# Altium schematic sheet fpga31-serdes-power.SchDoc
size Tabloid; SheetNumber: 54; SheetTotal: 71
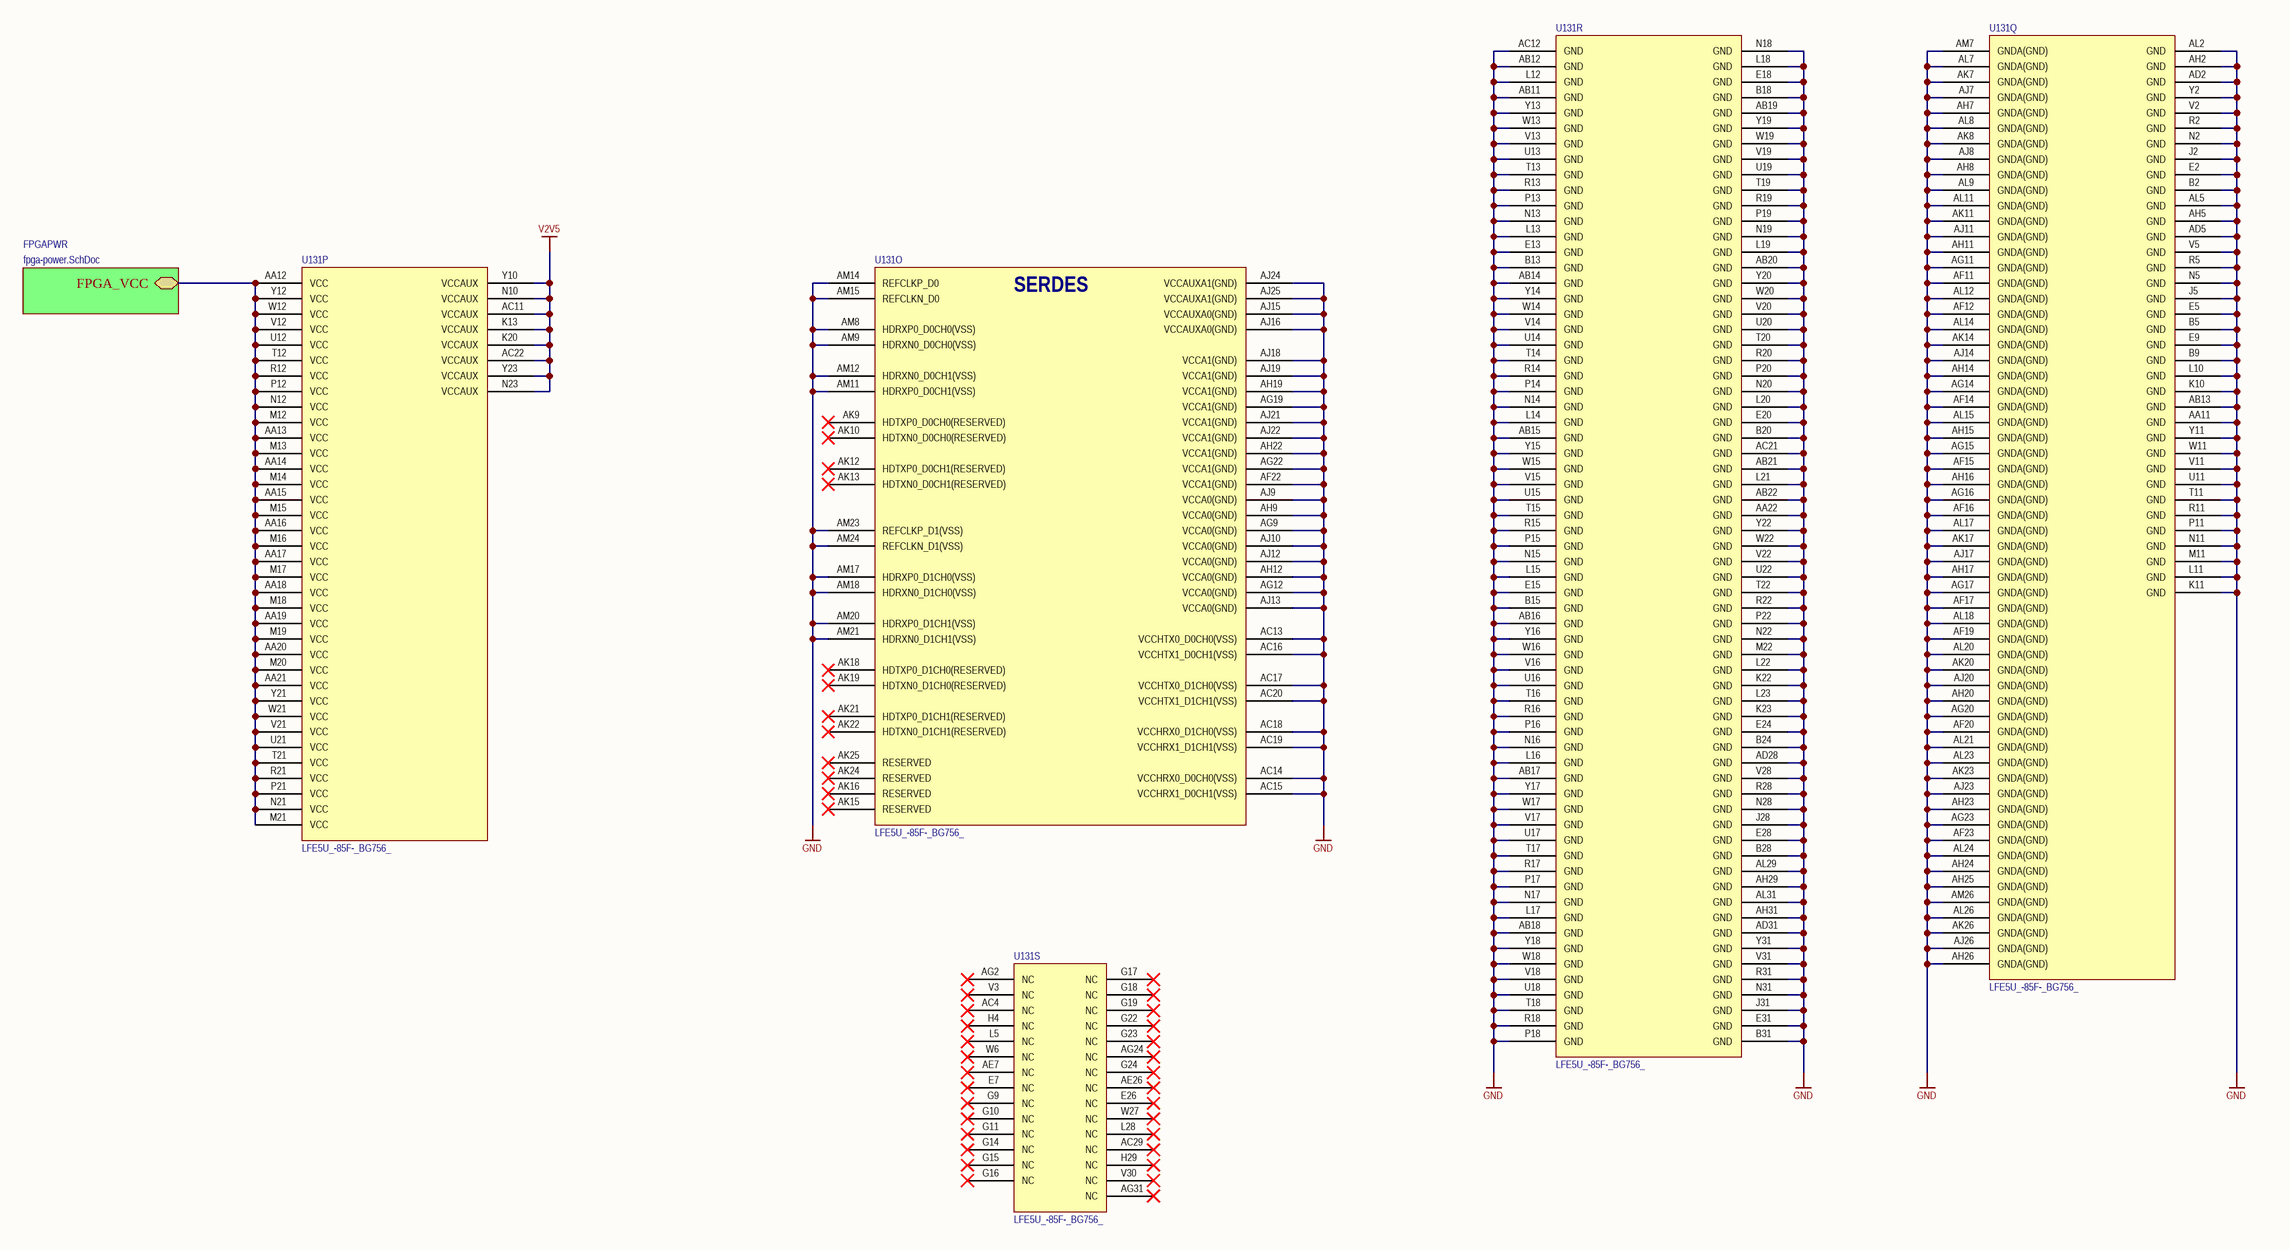
[diagram p0: fpga31-serdes-power.SchDoc]

## Parts
U131  LFE5U_-85F-_BG756_  [caBGA756]  (parts O,P,Q,R,S of 19)

## Sub-sheets
FPGAPWR = fpga-power.SchDoc: FPGA_VCC

## Nets
GND: U131.AA11(GND) U131.AA22(GND) U131.AB11(GND) U131.AB12(GND) U131.AB13(GND) U131.AB14(GND) U131.AB15(GND) U131.AB16(GND) U131.AB17(GND) U131.AB18(GND) U131.AB19(GND) U131.AB20(GND) U131.AB21(GND) U131.AB22(GND) U131.AC12(GND) U131.AC13(VCCHTX0_D0CH0(VSS)) U131.AC14(VCCHRX0_D0CH0(VSS)) U131.AC15(VCCHRX1_D0CH1(VSS)) U131.AC16(VCCHTX1_D0CH1(VSS)) U131.AC17(VCCHTX0_D1CH0(VSS)) U131.AC18(VCCHRX0_D1CH0(VSS)) U131.AC19(VCCHRX1_D1CH1(VSS)) U131.AC20(VCCHTX1_D1CH1(VSS)) U131.AC21(GND) U131.AD2(GND) U131.AD5(GND) U131.AD28(GND) U131.AD31(GND) U131.AF11(GNDA(GND)) U131.AF12(GNDA(GND)) U131.AF14(GNDA(GND)) U131.AF15(GNDA(GND)) U131.AF16(GNDA(GND)) U131.AF17(GNDA(GND)) U131.AF19(GNDA(GND)) U131.AF20(GNDA(GND)) U131.AF22(VCCA1(GND)) U131.AF23(GNDA(GND)) U131.AG9(VCCA0(GND)) U131.AG11(GNDA(GND)) U131.AG12(VCCA0(GND)) U131.AG14(GNDA(GND)) U131.AG15(GNDA(GND)) U131.AG16(GNDA(GND)) U131.AG17(GNDA(GND)) U131.AG19(VCCA1(GND)) U131.AG20(GNDA(GND)) U131.AG22(VCCA1(GND)) U131.AG23(GNDA(GND)) U131.AH2(GND) U131.AH5(GND) U131.AH7(GNDA(GND)) U131.AH8(GNDA(GND)) U131.AH9(VCCA0(GND)) U131.AH11(GNDA(GND)) U131.AH12(VCCA0(GND)) U131.AH14(GNDA(GND)) U131.AH15(GNDA(GND)) U131.AH16(GNDA(GND)) U131.AH17(GNDA(GND)) U131.AH19(VCCA1(GND)) U131.AH20(GNDA(GND)) U131.AH22(VCCA1(GND)) U131.AH23(GNDA(GND)) U131.AH24(GNDA(GND)) U131.AH25(GNDA(GND)) U131.AH26(GNDA(GND)) U131.AH29(GND) U131.AH31(GND) U131.AJ7(GNDA(GND)) U131.AJ8(GNDA(GND)) U131.AJ9(VCCA0(GND)) U131.AJ10(VCCA0(GND)) U131.AJ11(GNDA(GND)) U131.AJ12(VCCA0(GND)) U131.AJ13(VCCA0(GND)) U131.AJ14(GNDA(GND)) U131.AJ15(VCCAUXA0(GND)) U131.AJ16(VCCAUXA0(GND)) U131.AJ17(GNDA(GND)) U131.AJ18(VCCA1(GND)) U131.AJ19(VCCA1(GND)) U131.AJ20(GNDA(GND)) U131.AJ21(VCCA1(GND)) U131.AJ22(VCCA1(GND)) U131.AJ23(GNDA(GND)) U131.AJ24(VCCAUXA1(GND)) U131.AJ25(VCCAUXA1(GND)) U131.AJ26(GNDA(GND)) U131.AK7(GNDA(GND)) U131.AK8(GNDA(GND)) U131.AK11(GNDA(GND)) U131.AK14(GNDA(GND)) U131.AK17(GNDA(GND)) U131.AK20(GNDA(GND)) U131.AK23(GNDA(GND)) U131.AK26(GNDA(GND)) U131.AL2(GND) U131.AL5(GND) U131.AL7(GNDA(GND)) U131.AL8(GNDA(GND)) U131.AL9(GNDA(GND)) U131.AL11(GNDA(GND)) U131.AL12(GNDA(GND)) U131.AL14(GNDA(GND)) U131.AL15(GNDA(GND)) U131.AL17(GNDA(GND)) U131.AL18(GNDA(GND)) U131.AL20(GNDA(GND)) U131.AL21(GNDA(GND)) U131.AL23(GNDA(GND)) U131.AL24(GNDA(GND)) U131.AL26(GNDA(GND)) U131.AL29(GND) U131.AL31(GND) U131.AM7(GNDA(GND)) U131.AM8(HDRXP0_D0CH0(VSS)) U131.AM9(HDRXN0_D0CH0(VSS)) U131.AM11(HDRXP0_D0CH1(VSS)) U131.AM12(HDRXN0_D0CH1(VSS)) U131.AM14(REFCLKP_D0) U131.AM15(REFCLKN_D0) U131.AM17(HDRXP0_D1CH0(VSS)) U131.AM18(HDRXN0_D1CH0(VSS)) U131.AM20(HDRXP0_D1CH1(VSS)) U131.AM21(HDRXN0_D1CH1(VSS)) U131.AM23(REFCLKP_D1(VSS)) U131.AM24(REFCLKN_D1(VSS)) U131.AM26(GNDA(GND)) U131.B2(GND) U131.B5(GND) U131.B9(GND) U131.B13(GND) U131.B15(GND) U131.B18(GND) U131.B20(GND) U131.B24(GND) U131.B28(GND) U131.B31(GND) U131.E2(GND) U131.E5(GND) U131.E9(GND) U131.E13(GND) U131.E15(GND) U131.E18(GND) U131.E20(GND) U131.E24(GND) U131.E28(GND) U131.E31(GND) U131.J2(GND) U131.J5(GND) U131.J28(GND) U131.J31(GND) U131.K10(GND) U131.K11(GND) U131.K22(GND) U131.K23(GND) U131.L10(GND) U131.L11(GND) U131.L12(GND) U131.L13(GND) U131.L14(GND) U131.L15(GND) U131.L16(GND) U131.L17(GND) U131.L18(GND) U131.L19(GND) U131.L20(GND) U131.L21(GND) U131.L22(GND) U131.L23(GND) U131.M11(GND) U131.M22(GND) U131.N2(GND) U131.N5(GND) U131.N11(GND) U131.N13(GND) U131.N14(GND) U131.N15(GND) U131.N16(GND) U131.N17(GND) U131.N18(GND) U131.N19(GND) U131.N20(GND) U131.N22(GND) U131.N28(GND) U131.N31(GND) U131.P11(GND) U131.P13(GND) U131.P14(GND) U131.P15(GND) U131.P16(GND) U131.P17(GND) U131.P18(GND) U131.P19(GND) U131.P20(GND) U131.P22(GND) U131.R2(GND) U131.R5(GND) U131.R11(GND) U131.R13(GND) U131.R14(GND) U131.R15(GND) U131.R16(GND) U131.R17(GND) U131.R18(GND) U131.R19(GND) U131.R20(GND) U131.R22(GND) U131.R28(GND) U131.R31(GND) U131.T11(GND) U131.T13(GND) U131.T14(GND) U131.T15(GND) U131.T16(GND) U131.T17(GND) U131.T18(GND) U131.T19(GND) U131.T20(GND) U131.T22(GND) U131.U11(GND) U131.U13(GND) U131.U14(GND) U131.U15(GND) U131.U16(GND) U131.U17(GND) U131.U18(GND) U131.U19(GND) U131.U20(GND) U131.U22(GND) U131.V2(GND) U131.V5(GND) U131.V11(GND) U131.V13(GND) U131.V14(GND) U131.V15(GND) U131.V16(GND) U131.V17(GND) U131.V18(GND) U131.V19(GND) U131.V20(GND) U131.V22(GND) U131.V28(GND) U131.V31(GND) U131.W11(GND) U131.W13(GND) U131.W14(GND) U131.W15(GND) U131.W16(GND) U131.W17(GND) U131.W18(GND) U131.W19(GND) U131.W20(GND) U131.W22(GND) U131.Y2(GND) U131.Y11(GND) U131.Y13(GND) U131.Y14(GND) U131.Y15(GND) U131.Y16(GND) U131.Y17(GND) U131.Y18(GND) U131.Y19(GND) U131.Y20(GND) U131.Y22(GND) U131.Y31(GND)
V2V5: U131.AC11(VCCAUX) U131.AC22(VCCAUX) U131.K13(VCCAUX) U131.K20(VCCAUX) U131.N10(VCCAUX) U131.N23(VCCAUX) U131.Y10(VCCAUX) U131.Y23(VCCAUX)
NetU131_AA12: U131.AA12(VCC) U131.AA13(VCC) U131.AA14(VCC) U131.AA15(VCC) U131.AA16(VCC) U131.AA17(VCC) U131.AA18(VCC) U131.AA19(VCC) U131.AA20(VCC) U131.AA21(VCC) U131.M12(VCC) U131.M13(VCC) U131.M14(VCC) U131.M15(VCC) U131.M16(VCC) U131.M17(VCC) U131.M18(VCC) U131.M19(VCC) U131.M20(VCC) U131.M21(VCC) U131.N12(VCC) U131.N21(VCC) U131.P12(VCC) U131.P21(VCC) U131.R12(VCC) U131.R21(VCC) U131.T12(VCC) U131.T21(VCC) U131.U12(VCC) U131.U21(VCC) U131.V12(VCC) U131.V21(VCC) U131.W12(VCC) U131.W21(VCC) U131.Y12(VCC) U131.Y21(VCC) ; sheet FPGAPWR/FPGA_VCC

Not connected (* = marked no-connect by the designer): U131 AC4(NC)* AC29(NC)* AE7(NC)* AE26(NC)* AG2(NC)* AG24(NC)* AG31(NC)* AK9(HDTXP0_D0CH0(RESERVED))* AK10(HDTXN0_D0CH0(RESERVED))* AK12(HDTXP0_D0CH1(RESERVED))* AK13(HDTXN0_D0CH1(RESERVED))* AK15(RESERVED)* AK16(RESERVED)* AK18(HDTXP0_D1CH0(RESERVED))* AK19(HDTXN0_D1CH0(RESERVED))* AK21(HDTXP0_D1CH1(RESERVED))* AK22(HDTXN0_D1CH1(RESERVED))* AK24(RESERVED)* AK25(RESERVED)* E7(NC)* E26(NC)* G9(NC)* G10(NC)* G11(NC)* G14(NC)* G15(NC)* G16(NC)* G17(NC)* G18(NC)* G19(NC)* G22(NC)* G23(NC)* G24(NC)* H4(NC)* H29(NC)* L5(NC)* L28(NC)* V3(NC)* V30(NC)* W6(NC)* W27(NC)*

## Notes on the sheet
- (in symbol LFE5U_-85F-_BG756_, part O) SERDES

## Library data of the parts
U131 = LFE5U_-85F-_BG756_: ECP5 FPGA, 85k LUT, 756-caBGA; Manufacturer: Lattice Semiconductor; Manufacturer P/N: LFE5U_-85F-_BG756_